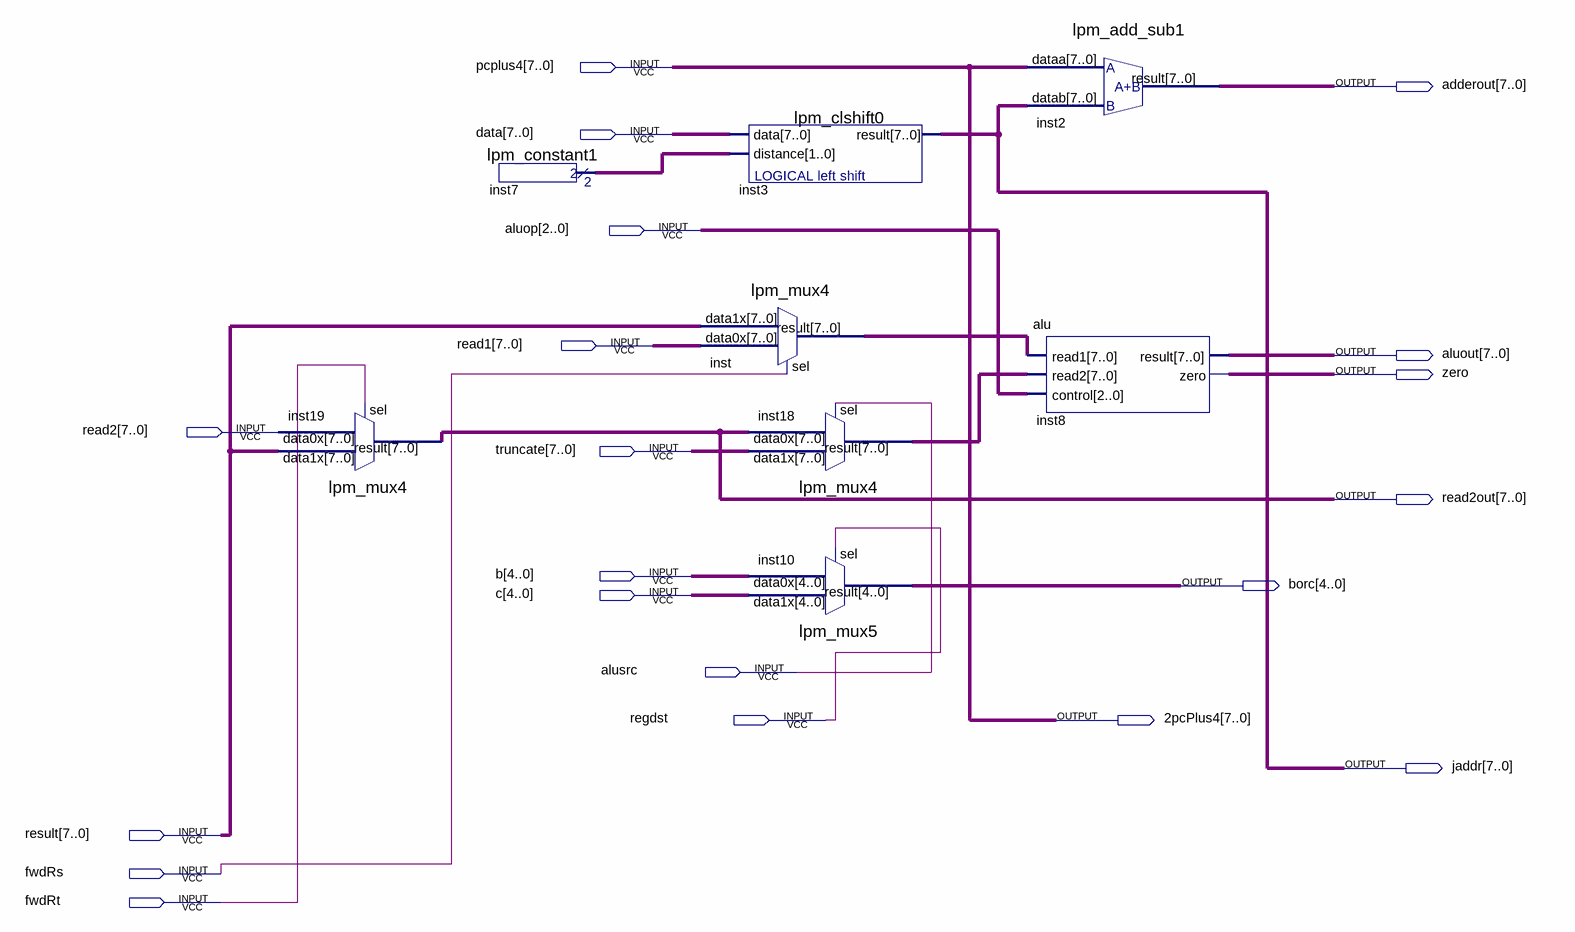
[diagram p0: schematic sheet]
// Quartus schematic alupipe.bdf as structural Verilog: 8 symbols, 20 pins
module alupipe (
  input  [7:0] pcplus4,
  input  [7:0] data,
  input  [2:0] aluop,
  input  [7:0] read1,
  input  [7:0] read2,
  input  [7:0] truncate,
  input  [4:0] b,
  input  [4:0] c,
  input  alusrc,
  input  regdst,
  input  [7:0] result,
  input  fwdRs,
  input  fwdRt,
  output [7:0] adderout,
  output [7:0] aluout,
  output zero,
  output [7:0] read2out,
  output [4:0] borc,
  output [7:0] \2pcPlus4 ,
  output [7:0] jaddr
);

  wire [1:0] inst7_result;
  wire [7:0] inst18_result, inst_result;

  lpm_mux4 inst19 (.data1x(result), .data0x(read2), .sel(fwdRt), .result(read2out));
  lpm_constant1 inst7 (.result(inst7_result));
  lpm_mux4 inst (.data1x(result), .data0x(read1), .sel(fwdRs), .result(inst_result));
  lpm_clshift0 inst3 (.data(data), .distance(inst7_result), .result(jaddr));
  lpm_mux4 inst18 (.data1x(truncate), .data0x(read2out), .sel(alusrc), .result(inst18_result));
  lpm_mux5 inst10 (.data1x(c), .data0x(b), .sel(regdst), .result(borc));
  lpm_add_sub1 inst2 (.dataa(pcplus4), .datab(jaddr), .result(adderout));
  alu inst8 (.read1(inst_result), .read2(inst18_result), .control(aluop), .result(aluout), .zero(zero));

  assign \2pcPlus4  = pcplus4;
endmodule
